# EAGLE schematic battery-charger (EAGLE 9.6.1)
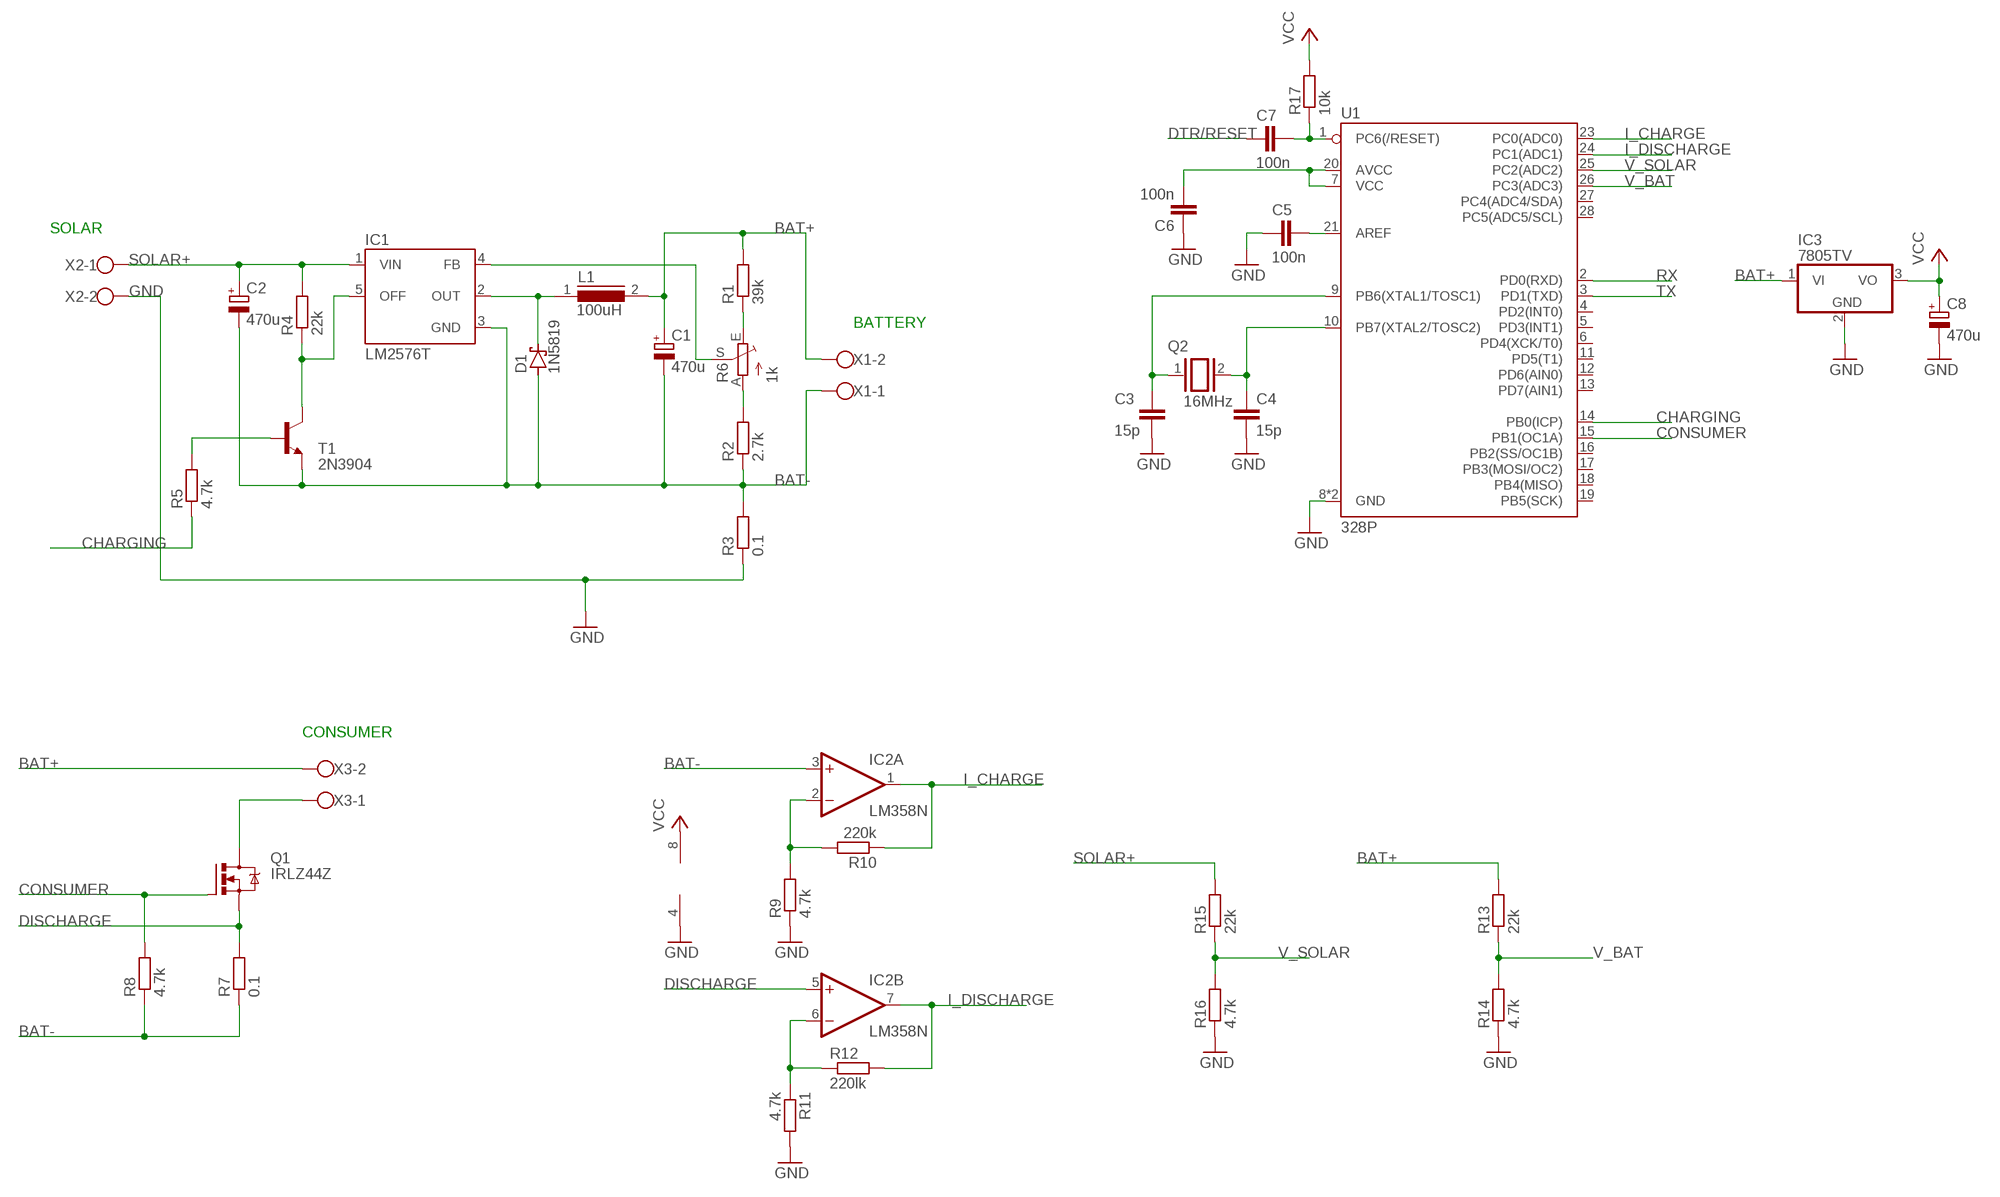
[diagram p0: schematic, sheet 1]

## Parts
C1  470u  CPOL-EUE7.5-16  [E7,5-16]
C2  470u  CPOL-EUE7.5-16  [E7,5-16]
C3  15p  C-EU025-030X050  [C025-030X050]
C4  15p  C-EU025-030X050  [C025-030X050]
C5  100n  C-EU025-030X050  [C025-030X050]
C6  100n  C-EU025-030X050  [C025-030X050]
C7  100n  C-EU025-030X050  [C025-030X050]
C8  470u  CPOL-EUE7.5-16  [E7,5-16]
D1  1N5819  1N5819-T  [DO41-7.6]
IC1  LM2576T  [TO220-5]
IC2  LM358N  [DIL08]
IC3  7805TV  [TO220V]
L1  100uH  A26GFC  [A26GFC]
Q1  IRLZ44Z  [TO220BH]
Q2  16MHz  XTAL/S  [QS]
R1  39k  R-EU_0207/10  [0207/10]
R2  2.7k  R-EU_0207/10  [0207/10]
R3  0.1  R-EU_0207/10  [0207/10]
R4  22k  R-EU_0207/10  [0207/10]
R5  4.7k  R-EU_0207/10  [0207/10]
R6  1k  TRIM_EU-RJ9W  [RJ9W]
R7  0.1  R-EU_0207/10  [0207/10]
R8  4.7k  R-EU_0207/10  [0207/10]
R9  4.7k  R-EU_0207/10  [0207/10]
R10  220k  R-EU_0207/10  [0207/10]
R11  4.7k  R-EU_0207/10  [0207/10]
R12  220lk  R-EU_0207/10  [0207/10]
R13  22k  R-EU_0207/10  [0207/10]
R14  4.7k  R-EU_0207/10  [0207/10]
R15  22k  R-EU_0207/10  [0207/10]
R16  4.7k  R-EU_0207/10  [0207/10]
R17  10k  R-EU_0207/10  [0207/10]
T1  2N3904  [TO92]
U1  328P  ATMEGA328P_PDIP  [DIP28]
X1  W237-102  [W237-102]
X2  W237-102  [W237-102]
X3  W237-102  [W237-102]

## Nets
BAT+: C1.+ IC3.1(VI) L1.2 R1.2 R13.2 X1.2 X3.2
BAT-: C1.- C2.- D1.A IC1.3(GND) IC2.3(A:+IN) R2.1 R3.2 R7.1 R8.1 T1.3(E) X1.1
CHARGING: R5.1 U1.14(PB0(ICP))
CONSUMER: Q1.G R8.2 U1.15(PB1(OC1A))
DISCHARGE: IC2.5(B:+IN) Q1.S R7.2
DTR/RESET: C7.2
GND: C3.2 C4.2 C5.2 C6.1 C8.- IC2.4(P:V-) IC3.2(GND) R3.1 R9.1 R11.2 R14.1 R16.1 U1.8(GND) U1.22(GND) X2.2
I_CHARGE: IC2.1(A:OUT) R10.1 U1.23(PC0(ADC0))
I_DISCHARGE: IC2.7(B:OUT) R12.2 U1.24(PC1(ADC1))
N$1: D1.C IC1.2(OUT) L1.1
N$2: IC2.2(A:-IN) R9.2 R10.2
N$3: IC1.4(FB) R6.S
N$4: R1.1 R6.E
N$5: R2.2 R6.A
N$6: C7.1 R17.1 U1.1(PC6(/RESET))
N$7: IC2.6(B:-IN) R11.1 R12.1
N$8: Q1.D X3.1
N$9: IC1.5(OFF) R4.1 T1.1(C)
N$10: R5.2 T1.2(B)
N$11: C6.2 U1.7(VCC) U1.20(AVCC)
N$12: C5.1 U1.21(AREF)
N$13: C3.1 Q2.1 U1.9(PB6(XTAL1/TOSC1))
N$14: C4.1 Q2.2 U1.10(PB7(XTAL2/TOSC2))
RX: U1.2(PD0(RXD))
SOLAR+: C2.+ IC1.1(VIN) R4.2 R15.2 X2.1
TX: U1.3(PD1(TXD))
V_BAT: R13.1 R14.2 U1.26(PC3(ADC3))
V_SOLAR: R15.1 R16.2 U1.25(PC2(ADC2))
VCC: C8.+ IC2.8(P:V+) IC3.3(VO) R17.2
Unconnected: U1.4(PD2(INT0)) U1.5(PD3(INT1)) U1.6(PD4(XCK/T0)) U1.11(PD5(T1)) U1.12(PD6(AIN0)) U1.13(PD7(AIN1)) U1.16(PB2(SS/OC1B)) U1.17(PB3(MOSI/OC2)) U1.18(PB4(MISO)) U1.19(PB5(SCK)) U1.27(PC4(ADC4/SDA)) U1.28(PC5(ADC5/SCL))

## Notes on the sheet
- SOLAR
- BATTERY
- CONSUMER

## Library data of the parts
C1 C2 C8 = rcl:CPOL-EU: POLARIZED CAPACITOR, European symbol; SPICEPREFIX: C
C3-C7 = rcl:C-EU: CAPACITOR, European symbol; SPICEPREFIX: C
D1 = diode:1N581*: 1.0A SCHOTTKY BARRIER RECTIFIER Source: http://www.diodes.com/datasheets/ds23001.pdf
IC1 = v-reg-3:LM2576: National Semiconductor <http://www.national.com> 3.0A "Simple Switcher"(c) 52kHz, Vout 1.23-37V (HV: 57V), Vin 40V (HV: 60V), 50µA standby current
IC2 = linear:LM358: OP AMP also LM158; LM258; LM2904 Source: http://cache.national.com/ds/LM/LM158.pdf
IC3 = linear:78*: Positive VOLTAGE REGULATOR Source: http://cache.national.com/ds/LM/LM78L05.pdf http://www.fairchildsemi.com/ds/LM/LM7805.pdf
L1 = inductors:A26GFC: INDUCTOR; SPICEPREFIX: L
Q1 = transistor-power:IRLZ44Z: N-Channel HEXFET® Power MOSFET Logic Level AUTOMOTIVE MOSFET Source: http://www.irf.com/product-info/datasheets/data/irlz44zpbf.pdf
Q2 = special:XTAL/S: CRYSTAL
R1-R5 R7-R17 = rcl:R-EU_: RESISTOR, European symbol; SPICEPREFIX: R
R6 = pot:TRIM_EU-: POTENTIOMETER
T1 = transistor:2N3904: NPN TRANSISTOR
U1 = SparkFun-IC-Microcontroller:ATMEGA328P_PDIP: Atmel 328P Through hole ATMEGA328P uC used in the Arduino 32kb flash, 1k EEPROM, 2k SRAM Datasheet <http://www.sparkfun.com/datasheets/Components/SMD/ATMega328.pdf> SparkFun Products Storefront component: AVR 28 Pin 20MHz 32K 6A/D - ATMega328P <https://www.sparkfun.com/products/9061> (COM-09061) SparkFun Simon Says - Through-Hole Soldering Kit <https://www.sparkfun.com/products/10547> (KIT-10547) SparkFun Learn to Solder - Simon Says <https://www.sparkfun.com/products/13708> (KIT-13708) SparkFun BigTime Watch Kit <https://www.sparkfun.com/products/11734> (KIT-11734) SparkFun ClockIt <https://www.sparkfun.com/products/10930> (KIT-10930) SparkFun Serial Enabled LCD Kit <https://www.sparkfun.com/products/10097> (LCD-10097) SparkFun Simon Tilts - Through Hole Soldering Kit <https://www.sparkfun.com/products/12634> (KIT-12634) SparkFun Frequency Counter Kit <https://www.sparkfun.com/products/10140> (KIT-10140) FabFM Radio Kit <https://www.sparkfun.com/products/11043> (KIT-11043) SparkFun Binary Blaster Kit <https://www.sparkfun.com/products/12037> (KIT-12037) SparkFun Metro-Gnome <https://www.sparkfun.com/products/9236> (KIT-09236) ATmega328 with Arduino Optiboot (Uno) <https://www.sparkfun.com/products/10524> (DEV-10524); PROD_ID: IC-09136
X1-X3 = con-wago-500:W237-102: WAGO SCREW CLAMP; MPN: 237-102; OC_FARNELL: unknown; OC_NEWARK: 70K9898